# EAGLE design Group 13 Layout and sch v3 (EAGLE 9.2.0)
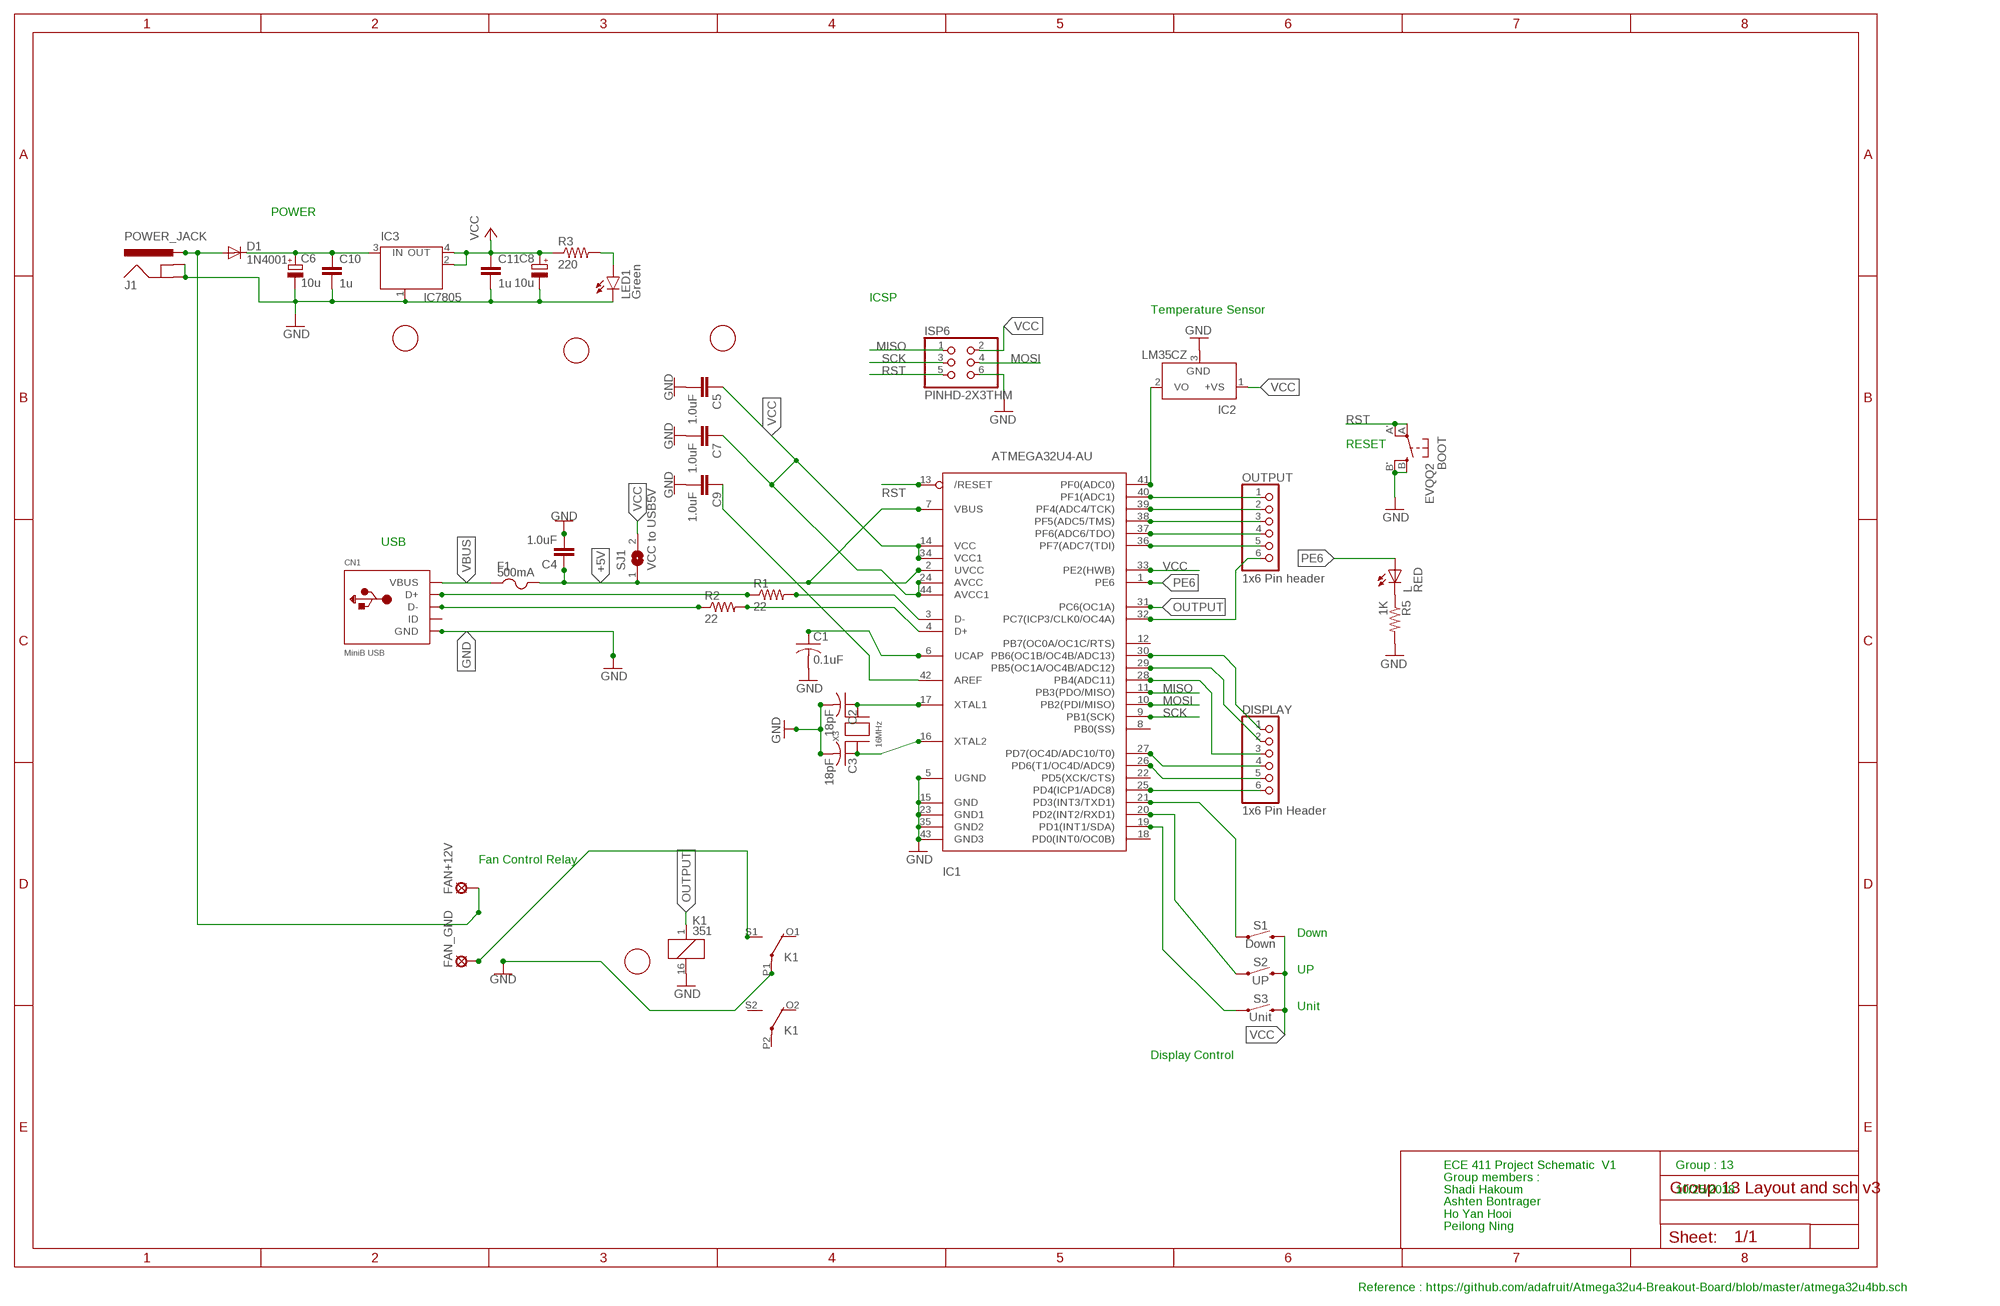
[diagram p0: schematic, sheet 1]

## Parts
BOOT  EVQQ2  [EVQ-Q2]
C1  0.1uF  C-USC0805K  [C0805K]
C2  18pF  C-USC0805K  [C0805K]
C3  18pF  C-USC0805K  [C0805K]
C4  1.0uF  1.0UF-0603-16V-10%  [0603]
C5  1.0uF  1.0UF-0603-16V-10%  [0603]
C6  10u  CPOL-EUC  [PANASONIC_C]
C7  1.0uF  1.0UF-0603-16V-10%  [0603]
C8  10u  CPOL-EUC  [PANASONIC_C]
C9  1.0uF  1.0UF-0603-16V-10%  [0603]
C10  1u  C-EUC0805  [C0805]
C11  1u  C-EUC0805  [C0805]
CN1  MiniB USB  USBMINIB  [USB-MINIB]
D1  1N4001  BYT85  [DO220S]
DISPLAY  1x6 Pin Header  PINHD-1X6B  [1X06-BIG]
F1  500mA  PTCFUSE-1206  [R1206]
FAN+12V  LSP10  [LSP10]
FAN_GND  LSP11  [LSP11]
IC1  ATMEGA32U4-AU  [TQFP44]
IC2  LM35CZ  [TO92]
IC3  IC7805  MC33269ST-3.3T3  [SOT223]
ISP6  PINHD-2X3THM  [ISP6]
J1  POWER_JACK  [POWER_JACK_PTH]
K1  351  [351]
L  RED  LEDCHIPLED_0805  [CHIPLED_0805]
LED1  Green  LED5MM  [LED5MM]
OUTPUT  1x6 Pin header  PINHD-1X6B  [1X06-BIG]
R1  22  R-US_R0805  [R0805]
R2  22  R-US_R0805  [R0805]
R3  220  R-US_R0805  [R0805]
R5  1K  R-US_R0805  [R0805]
S1  Down  MOMENTARY-SWITCH-SPST-PTH-6.0MM  [TACTILE_SWITCH_PTH_6.0MM]
S2  UP  MOMENTARY-SWITCH-SPST-PTH-6.0MM  [TACTILE_SWITCH_PTH_6.0MM]
S3  Unit  MOMENTARY-SWITCH-SPST-PTH-6.0MM  [TACTILE_SWITCH_PTH_6.0MM]
SJ1  VCC to USB5V  SJ  [SJ]
U$1  FIDUCIAL  [FIDUCIAL_1MM]
U$2  FIDUCIAL  [FIDUCIAL_1MM]
U$3  FIDUCIAL  [FIDUCIAL_1MM]
U$6  FIDUCIAL  [FIDUCIAL_1MM]
X3  16MHz  XTALNX5032  [NX5032]

## Nets
3.3V: C1.1 IC1.6(UCAP)
+5V: C4.1 F1.2 IC1.2(UVCC) IC1.7(VBUS) SJ1.1
D+: CN1.D+ R1.1
D-: CN1.D- R2.1
GND: BOOT.B'(S1) BOOT.B(S) C1.2 C2.2 C3.2 C4.2 C5.2 C6.- C7.2 C8.- C9.2 C10.2 C11.2 CN1.GND IC1.5(UGND) IC1.15(GND) IC1.23(GND1) IC1.35(GND2) IC1.43(GND3) IC2.3(GND) IC3.1(GND/ADJ) ISP6.6 J1.GND J1.GNDBREAK K1.16 K1.P1(2:P) LED1.K(C) R5.2
MISO: IC1.11(PB3(PDO/MISO)) ISP6.1
MOSI: IC1.10(PB2(PDI/MISO)) ISP6.4
N$1: DISPLAY.6 IC1.25(PD4(ICP1/ADC8))
N$2: C6.+ C10.1 D1.C IC3.3(IN)
N$3: IC1.3(D-) R1.2
N$4: IC1.4(D+) R2.2
N$5: LED1.A R3.2
N$7: IC1.40(PF1(ADC1)) OUTPUT.1
N$8: C2.1 IC1.17(XTAL1) X3.P$2
N$9: C3.1 IC1.16(XTAL2) X3.P$1
N$10: L.C R5.1
N$11: IC1.38(PF5(ADC5/TMS)) OUTPUT.3
N$12: DISPLAY.5 IC1.26(PD6(T1/OC4D/ADC9))
N$13: FAN_GND.MP K1.S1(2:S)
N$16: DISPLAY.4 IC1.27(PD7(OC4D/ADC10/T0))
N$17: DISPLAY.3 IC1.28(PB4(ADC11))
N$18: DISPLAY.2 IC1.29(PB5(OC1A/OC4B/ADC12))
N$19: DISPLAY.1 IC1.30(PB6(OC1B/OC4B/ADC13))
N$20: IC1.19(PD1(INT1/SDA)) S3.1
N$21: IC1.20(PD2(INT2/RXD1)) S2.1
N$22: IC1.21(PD3(INT3/TXD1)) S1.1
N$24: IC1.37(PF6(ADC6/TDO)) OUTPUT.4
N$25: IC1.36(PF7(ADC7(TDI)) OUTPUT.5
N$26: IC1.32(PC7(ICP3/CLK0/OC4A)) OUTPUT.6
N$28: C9.1 IC1.42(AREF)
N$29: D1.A FAN+12V.MP J1.PWR
OUTPUT: IC1.31(PC6(OC1A)) K1.1
PE6: IC1.1(PE6) L.A
PF4: IC1.39(PF4(ADC4/TCK)) OUTPUT.2
PF7: IC1.41(PF0(ADC0)) IC2.2(VO)
RST: BOOT.A'(P1) BOOT.A(P) IC1.13(/RESET) ISP6.5
SCK: IC1.9(PB1(SCK)) ISP6.3
VBUS: CN1.VBUS F1.1
VCC: C5.1 C7.1 C8.+ C11.1 IC1.14(VCC) IC1.24(AVCC) IC1.33(PE2(HWB)) IC1.34(VCC1) IC1.44(AVCC1) IC2.1(+VS) IC3.2(OUT) IC3.4(OUT) ISP6.2 R3.1 S1.3 S2.3 S3.3 SJ1.2
Unconnected: CN1.ID IC1.8(PB0(SS)) IC1.12(PB7(OC0A/OC1C/RTS)) IC1.18(PD0(INT0/OC0B)) IC1.22(PD5(XCK/CTS)) K1.O1(2:O) K1.O2(3:O) K1.P2(3:P) K1.S2(3:S)

## Notes on the sheet
- POWER
- ICSP
- Temperature Sensor
- RESET
- USB
- Fan Control Relay
- Down
- UP
- Unit
- Display Control
- ECE 411 Project Schematic  V1 | Group : 13
- Group members :
- Shadi Hakoum | 10/25/2018
- Ashten Bontrager
- Ho Yan Hooi
- Peilong Ning
- Reference : https://github.com/adafruit/Atmega32u4-Breakout-Board/blob/master/atmega32u4bb.sch

## Library data of the parts
BOOT = adaprog:EVQQ2
C1-C3 = adafruit:C-US: CAPACITOR, American symbol
C4 C5 C7 C9 = SparkFun-Capacitors:1.0UF: 1µF ceramic capacitors A capacitor is a passive two-terminal electrical component used to store electrical energy temporarily in an electric field.; PROD_ID: CAP-00868
C6 C8 = rcl:CPOL-EU: POLARIZED CAPACITOR, European symbol; SPICEPREFIX: C
C10 C11 = rcl:C-EU: CAPACITOR, European symbol; SPICEPREFIX: C
CN1 = adafruit:USB: USB Connectors USBMINIB - Surface Mount Female Mini-B USB Connector 4UConnector: 06564 By microbuilder.eu Thru-hole RA Female Mini-B USB Connector 4UConnector: 18732 By ladyada.net
D1 = diode:BYT85: DIODE
DISPLAY OUTPUT = adafruit:PINHD-1X6: PIN HEADER
F1 = adafruit:PTCFUSE: PTC fuses, resettable thermistors
FAN+12V = solpad:LSP10: SOLDER PAD drill 1.0 mm, distributor Buerklin, 12H555
FAN_GND = solpad:LSP11: SOLDER PAD drill 1.1 mm
IC1 = adaprog:ATMEGA32U4
IC2 = lm35:LM35: Single-Supply Centigrade Temperature Sensor Vout = (10mV/°C x Temp °C) +5mmmV Source: http://www.national.com/ds/LM/LM35.pdf
IC3 = linear:MC33269ST*: Adjustable Output Low Dropout Voltage Regulator 800 mA Source: http://www.onsemi.com/pub/Collateral/MC33269-D.PDF
ISP6 = adaprog:PINHD-2X3
J1 = SparkFun-Connectors:POWER_JACK: Power Jack Connector This is the standard 5.5mm barrel jack for power. The PTH is the most common, proven, reliable, footprint. The Slot footprint only works if the mill layer is transmitted to the PCB fab house so be warned. Here are the connectors we sell at SparkFun: DC Barrel Power Jack/Connector <https://www.sparkfun.com/products/119> (PRT-00119) DC Barrel Power Jack/Connector (SMD) <https://www.sparkfun.com/products/12748> (PRT-12748) DC Barrel Jack Adapter - Breadboard Compatible <https://www.sparkfun.com/products/10811> (PRT-10811) It is used on this SparkFun product (and many, many others): SparkFun RedBoard - Programmed with Arduino <https://www.sparkfun.com/products/12757> (DEV-12757) Also, if you need a mating power supply or connector, please check these out: Wall Adapter Power Supply - 9VDC 650mA <https://www.sparkfun.com/products/298> (TOL-00298) DC Barrel Jack Adapter - Male <https://www.sparkfun.com/products/10287> (PRT-10287); PROD_ID: CONN-08197
K1 = relay:351: RELAY 2 x switch, Omron; OC_FARNELL: unknown; OC_NEWARK: unknown
L = adafruit:LED: LED
LED1 = led:LED: LED
R1 R2 R5 = adafruit:R-US_: RESISTOR, American symbol
R3 = rcl:R-US_: RESISTOR, American symbol; SPICEPREFIX: R
S1-S3 = SparkFun-Switches:MOMENTARY-SWITCH-SPST: Momentary Switch (Pushbutton) - SPST Normally-open (NO) SPST momentary switches (buttons, pushbuttons). Variants PTH-12MM - 12mm square, through-hole Momentary Pushbutton Switch - 12mm Square <https://www.sparkfun.com/products/9190> (COM-09190) PTH-6.0MM, PTH-6.0MM-KIT - 6.0mm square, through-hole Mini Pushbutton Switch <https://www.sparkfun.com/products/97> (COM-00097) KIT package intended for soldering kit's - only one side of pads' copper is exposed. PTH-RIGHT-ANGLE-KIT - Right-angle, through-hole Right Angle Tactile Button <https://www.sparkfun.com/products/10791> - Used on SparkFun BigTime Watch Kit <https://www.sparkfun.com/products/11734> SMD-12MM - 12mm square, surface-mount Tactile Button - SMD (12mm) <https://www.sparkfun.com/products/12993> (COM-12993) Used on SparkFun PicoBoard <https://www.sparkfun.com/products/11888> SMD-4.5MM - 4.5mm Square Trackball Switch Used on SparkFun Blackberry Trackballer Breakout <https://www.sparkfun.com/products/13169> SMD-4.6MMX2.8MM - 4.60mm x 2.80mm, surface mount Used on SparkFun SAMD21 Mini Breakout <https://www.sparkfun.com/products/13664> SMD-5.2MM, SMD-5.2-REDUNDANT - 5.2mm square, surface-mount Mini Pushbutton Switch - SMD <https://www.sparkfun.com/products/8720> (COM-08720) Used on Arduino Pro Mini <https://www.sparkfun.com/products/11114> REDUNDANT package connects both switch circuits together SMD-6.0X3.5MM - 6.0 x 3.5mm, surface mount Momentary Reset Switch SMD <https://www.sparkfun.com/products/8229> (COM-08229) SMD-6.2MM-TALL - 6.2mm square, surface mount Tactile Button - SMD (6mm) <https://www.sparkfun.com/products/12992> Used on SparkFun Digital Sandbox <https://www.sparkfun.com/products/12651> SMD-RIGHT-ANGLE - Right-angle, surface mount Used on SparkFun Block for Intel® Edison - Arduino <https://www.sparkfun.com/products/13036>; PROD_ID: SWCH-08441; SF_SKU: COM-00097
SJ1 = jumper:SJ: SMD solder JUMPER
U$1-U$3 U$6 = adafruit:FIDUCIAL: For use by pick and place machines to calibrate the vision/machine, 1mm By microbuilder.eu
X3 = adaprog:XTAL

## Board
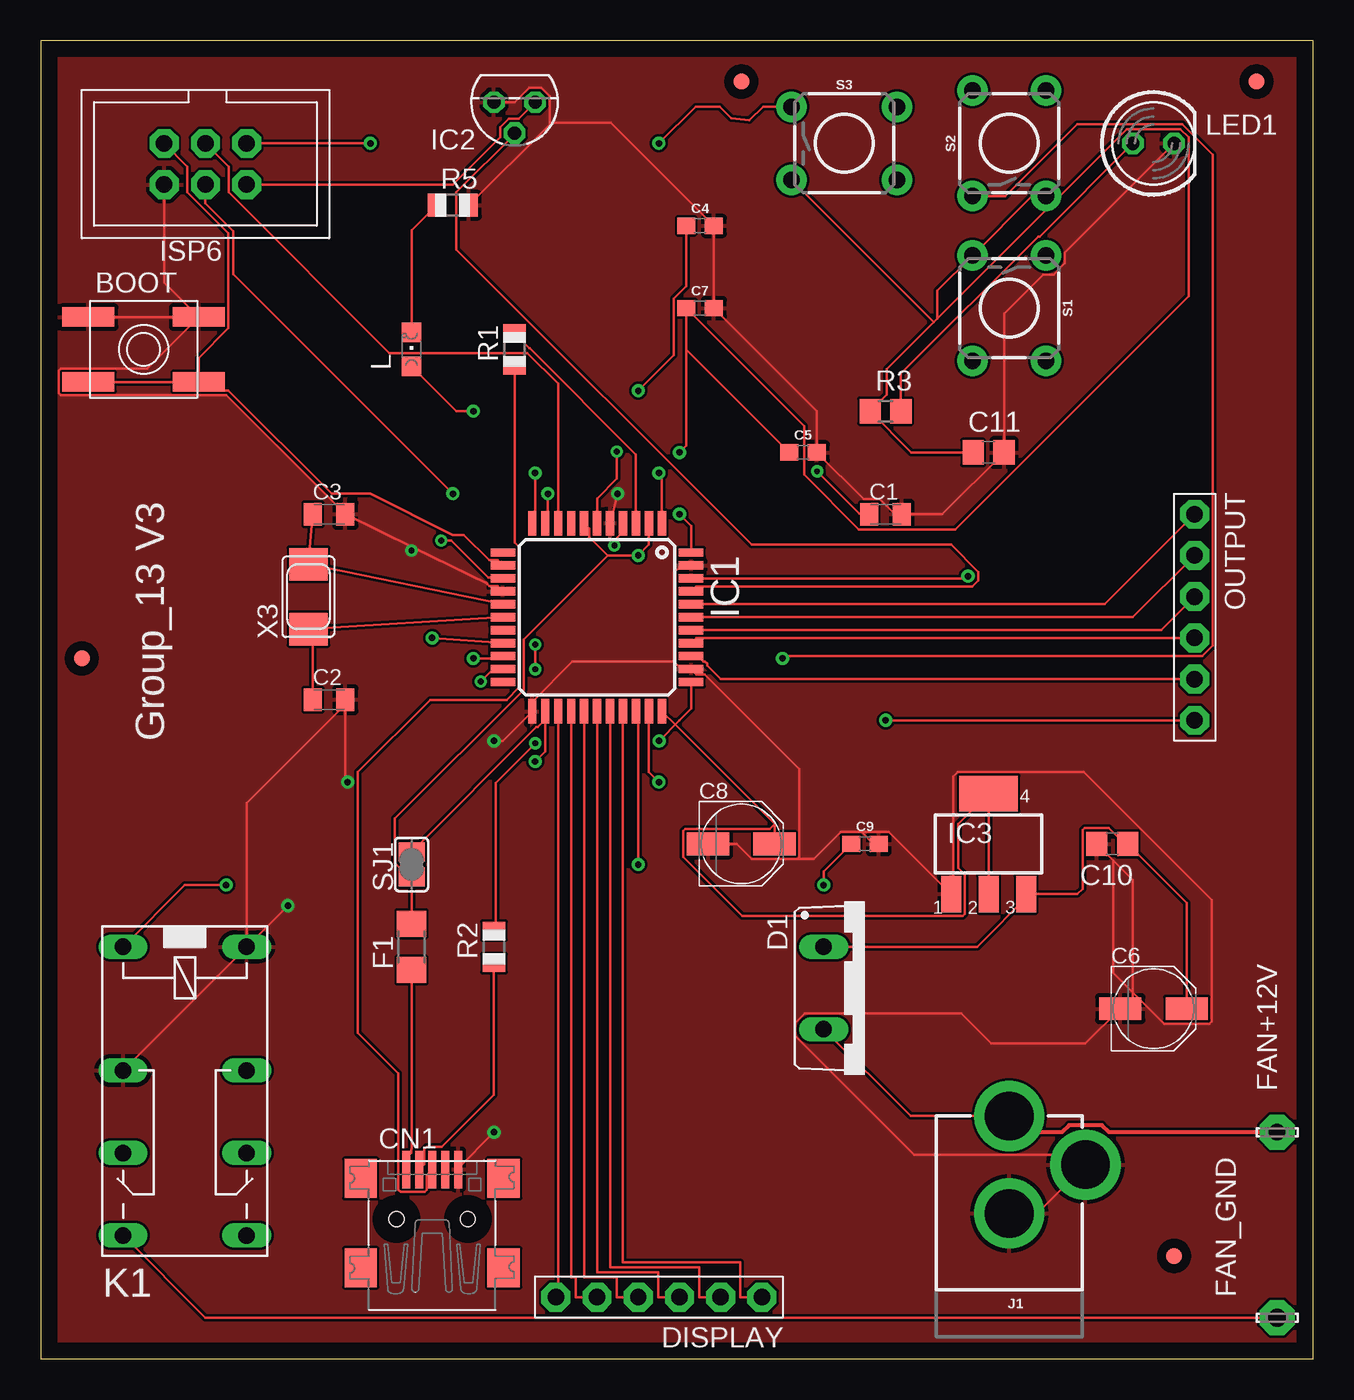
[diagram p1: board, top side]
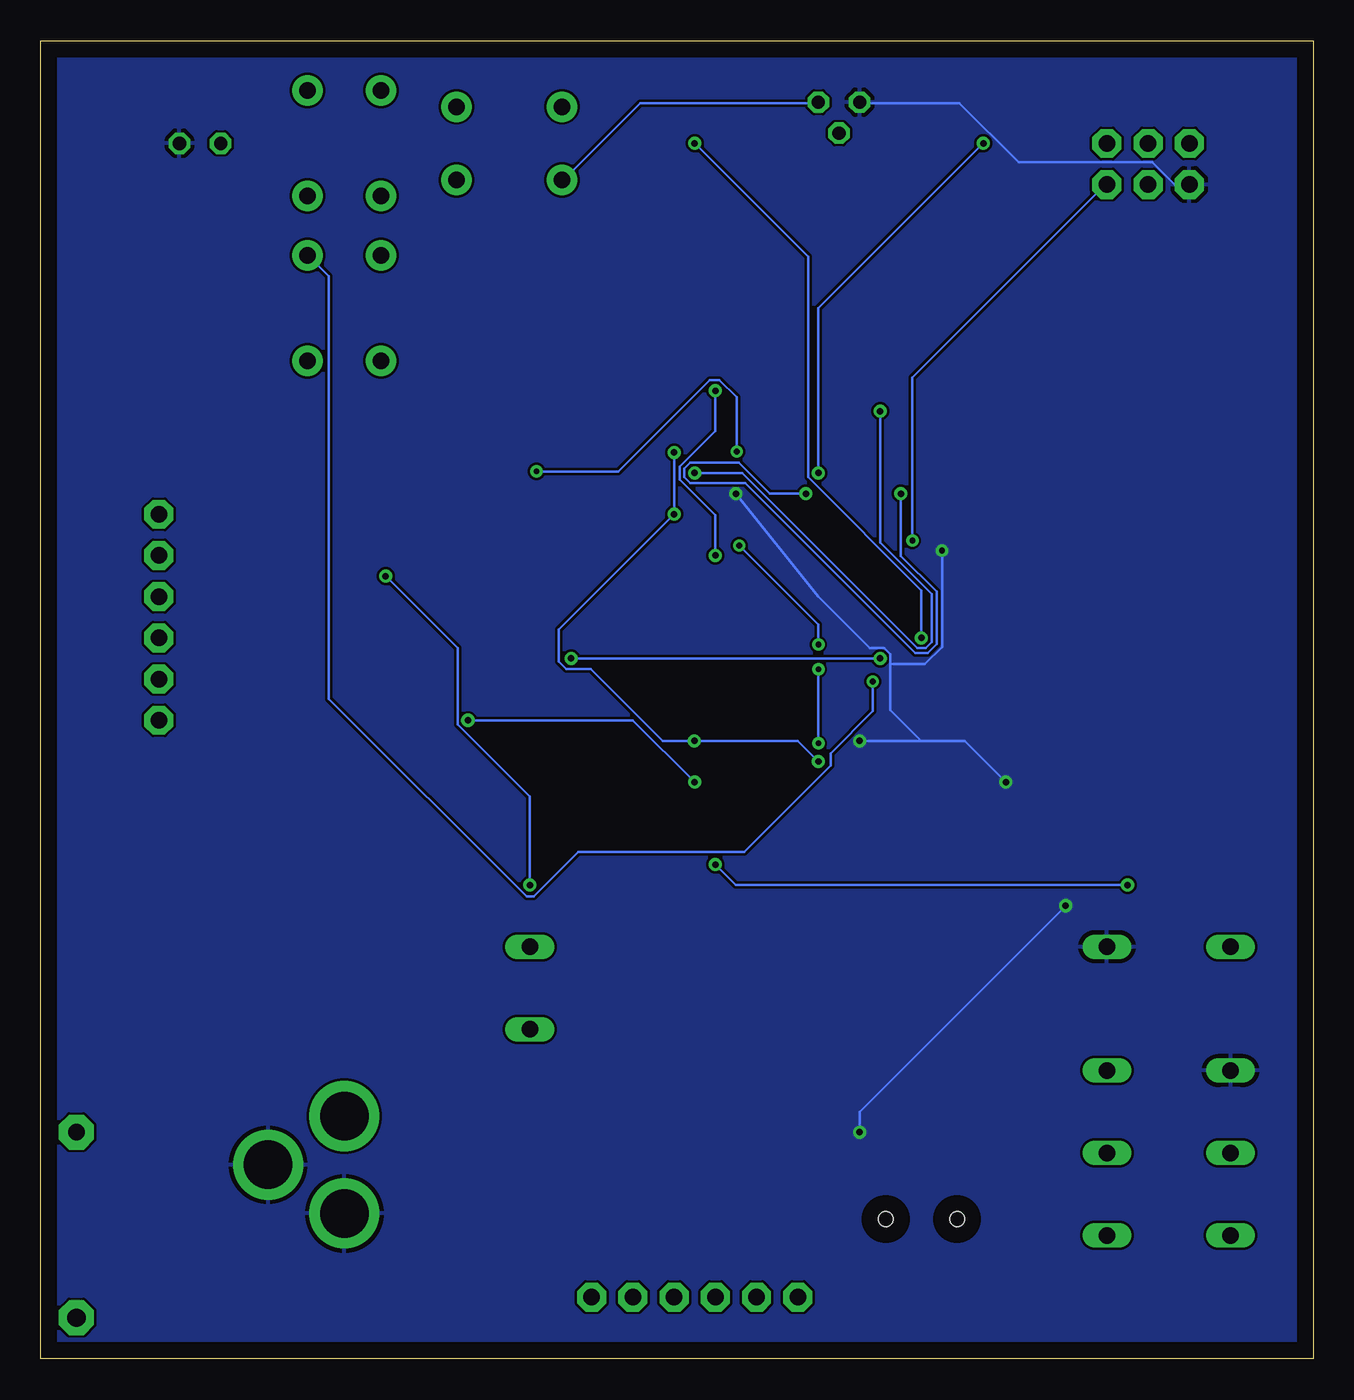
[diagram p2: board, bottom side, seen from below]

Size 78.41 x 81.27 mm. Coordinates in mm from the lower left corner, seen from the top.
Outline: 0,0 78.41,0 78.41,81.27 0,81.27 0,0
Copper layers (1*16): Top 0.035mm / dielectric 1.5mm / Bottom 0.035mm
Design rules "default": minimum track width 6mil, minimum drill 0.35mm, track to track 6mil, track to pad 6mil, pad to pad 6mil, via to via 6mil, smd to smd 6mil, copper to edge 40mil, drill to drill 6mil, minimum pad ring 10mil, minimum via ring 8mil, stop-mask expansion 4mil, vias tented up to drill 0mil, thermal gap 10mil

### Footprints (pad centres in the part's own frame; a part is rotated, then mirrored left to right if it is on the bottom)
EVQ-Q2 = smd 3.2 x 1.2: A -3.4,-2; A' 3.4,-2; B -3.4,2; B' 3.4,2
C0805K = smd 1.1 x 1.4: 1 -1,0; 2 1,0
0603 = smd 1.1 x 1: 1 -0.85,0; 2 0.85,0
PANASONIC_C = smd 2.6 x 1.4: + 2.05,0; - -2.05,0
C0805 = smd 1.3 x 1.5: 1 -0.95,0; 2 0.95,0
USB-MINIB = smd 0.5 x 2.308: D+ 0,4.064; D- -0.8,4.064; GND 1.6,4.064; ID 0.8,4.064; VBUS -1.6,4.064 | smd 2 x 2.4: GND1 -4.4,-2; GND2 -4.4,3.5; GND3 4.4,3.5; GND4 4.4,-2 | hole 0.9: -2.2,1; 2.2,1
DO220S = drill 1.016 long: A 2.54,-2.54; C -2.54,-2.54
1X06-BIG = drill 1.016 pad 1.778 octagon: 1 -6.35,0; 2 -3.81,0; 3 -1.27,0; 4 1.27,0; 5 3.81,0; 6 6.35,0
R1206 = smd 1.6 x 1.803: 1 -1.422,0; 2 1.422,0
LSP10 = drill 1.016 pad 2.159 octagon: MP 0,0
LSP11 = drill 1.118 pad 2.159 octagon: MP 0,0
TQFP44 = smd 1.5 x 0.5: 1 -5.8,4; 2 -5.8,3.2; 3 -5.8,2.4; 4 -5.8,1.6; 5 -5.8,0.8; 6 -5.8,0; 7 -5.8,-0.8; 8 -5.8,-1.6; 9 -5.8,-2.4; 10 -5.8,-3.2; 11 -5.8,-4; 23 5.8,-4; 24 5.8,-3.2; 25 5.8,-2.4; 26 5.8,-1.6; 27 5.8,-0.8; 28 5.8,0; 29 5.8,0.8; 30 5.8,1.6; 31 5.8,2.4; 32 5.8,3.2; 33 5.8,4 | smd 0.5 x 1.5: 12 -4,-5.8; 13 -3.2,-5.8; 14 -2.4,-5.8; 15 -1.6,-5.8; 16 -0.8,-5.8; 17 0,-5.8; 18 0.8,-5.8; 19 1.6,-5.8; 20 2.4,-5.8; 21 3.2,-5.8; 22 4,-5.8; 34 4,5.8; 35 3.2,5.8; 36 2.4,5.8; 37 1.6,5.8; 38 0.8,5.8; 39 0,5.8; 40 -0.8,5.8; 41 -1.6,5.8; 42 -2.4,5.8; 43 -3.2,5.8; 44 -4,5.8
TO92 = drill 0.813 octagon: 1 -1.27,0; 2 0,1.905; 3 1.27,0
SOT223 = smd 1.219 x 2.235: 1 -2.311,-3.099; 2 0,-3.099; 3 2.311,-3.099 | smd 3.6 x 2.2: 4 0,3.099
ISP6 = drill 1.016 pad 1.778 octagon: 1 -2.54,-1.27; 2 -2.54,1.27; 3 0,-1.27; 4 0,1.27; 5 2.54,-1.27; 6 2.54,1.27
POWER_JACK_PTH = drill 2.997 pad 4.318: GND 0,7.7; GNDBREAK 4.7,10.7; PWR 0,13.7
351 = drill 1.016 long: 1 -3.81,-3.81; 16 -3.81,3.81; O1 8.89,-3.81; O2 8.89,3.81; P1 3.81,-3.81; P2 3.81,3.81; S1 13.97,-3.81; S2 13.97,3.81
CHIPLED_0805 = smd 1.2 x 1.2: A 0,-1.05; C 0,1.05
LED5MM = drill 0.813 octagon: A -1.27,0; K 1.27,0
R0805 = smd 1.1 x 1.4: 1 -1,0; 2 1,0
R0805' = smd 1.3 x 1.5: 1 -0.95,0; 2 0.95,0
TACTILE_SWITCH_PTH_6.0MM = drill 1.016 pad 1.88: 1 -3.251,2.261; 2 3.251,2.261; 3 -3.251,-2.261; 4 3.251,-2.261
SJ = smd 1.168 x 1.6: 1 -0.762,0; 2 0.762,0
FIDUCIAL_1MM = smd 1 x 1: 1 0,0
NX5032 = smd 2 x 2.4: P$1 2,0; P$2 -2,0

### Placement (x,y rotation side)
BOOT  6.35,62.23 0 top
C1  52.07,52.07 0 top
C2  17.78,40.64 0 top
C3  17.78,52.07 0 top
C4  40.64,69.85 0 top
C5  46.99,55.88 0 top
C6  68.58,21.59 0 top
C7  40.64,64.77 0 top
C8  43.18,31.75 0 top
C9  50.8,31.75 0 top
C10  66.04,31.75 180 top
C11  58.42,55.88 0 top
CN1  24.13,7.62 0 top
D1  50.8,22.86 270 top
DISPLAY  38.1,3.81 180 top
F1  22.86,25.4 90 top
FAN+12V  76.2,13.97 0 top
FAN_GND  76.2,2.54 0 top
IC1  34.29,45.72 270 top
IC2  29.21,77.47 180 top
IC3  58.42,31.75 0 top
ISP6  10.16,73.66 180 top
J1  59.69,1.27 0 top
K1  8.89,21.59 270 top
L  22.86,62.23 0 top
LED1  68.58,74.93 0 top
OUTPUT  71.12,45.72 270 top
R1  29.21,62.23 90 top
R2  27.94,25.4 90 top
R3  220  [R0805']  52.07,58.42 0 top
R5  25.4,71.12 0 top
S1  59.69,64.77 270 top
S2  59.69,74.93 90 top
S3  49.53,74.93 0 top
SJ1  22.86,30.48 90 top
U$1  74.93,78.74 0 top
U$2  43.18,78.74 0 top
U$3  69.85,6.35 0 top
U$6  2.54,43.18 0 top
X3  16.51,46.99 90 top

### Tracks (layer width: path | path; a pad name or v marks a point on that pad's centre or on a via)
3.3V  (via drill 0.35)
  Top 0.152: v47.85,54.71 50.44,52.12 51.05,52.12 C1.1 | v35.51,55.93 35.51,54.25 34.29,53.03 IC1.6
  Bottom 0.152: v47.85,54.71 42.82,54.71 37.19,60.35 36.58,60.35 35.51,59.28 v35.51,55.93
+5V  (via drill 0.4 pad 0.75)
  Top 0.152: SJ1.1 22.86,29.53 | 22.86,29.53 F1.2 | C4.1 39.79,66.14 39.01,65.36 39.01,61.87 v36.83,59.69 | IC1.2 37.49,50.19 v36.83,49.53 34.96,49.53 | IC1.7 33.81,51.2 33.81,50.67 34.96,49.53 | 34.96,49.53 29.77,44.35 29.77,41.25 21.83,33.31 21.83,30.56 22.86,29.53
  Bottom 0.152: v36.83,59.69 36.83,57.2 39.04,55 39.04,54.22 36.83,52.02 v36.83,49.53
D+
  Top 0.152: R1.1 29.21,50.32 29.47,50.06 29.47,41.38 28.71,40.62 24,40.62 19.56,36.17 19.56,20.09 22.05,17.6 22.05,10.44 22.18,10.3 23.68,10.3 23.81,10.44 23.81,11.36 CN1.D+
D-
  Top 0.152: R2.1 27.94,16.29 24.71,13.07 23.79,13.07 23.65,12.93 23.65,12.01 CN1.D-
GND  (via drill 0.35, 0.4 pad 0.75)
  Top 0.152: BOOT.B BOOT.B' | ISP6.6 7.62,66.36 BOOT.B' | BOOT.B' 6.58,61.06 1.25,61.06 1.12,60.92 1.12,59.53 1.25,59.4 11.45,59.4 C3.2 23.02,50 | 23.02,50 27.51,47.8 27.51,47.77 27.64,47.64 28.17,47.64 IC1.15 | K1.16 12.7,34.27 19.05,40.62 C2.2 18.78,35.71 v18.93,35.56 | C9.2 51.32,31.75 50.59,32.48 | 50.59,32.48 49.3,32.48 47.65,30.82 46.62,30.82 | 50.59,32.48 52.28,32.48 55.72,29.05 | 55.72,29.05 IC3.1 | 46.62,30.82 43.84,30.82 42.91,31.75 C8.- | 46.62,30.82 46.76,30.95 46.76,36.38 40.94,42.2 40.41,42.2 IC1.35 40.08,42.67 39.32,42.67 39.01,42.98 | 55.72,29.05 56.25,29.58 56.25,35.9 56.52,36.18 64.29,36.18 72.16,28.3 72.16,20.8 72.03,20.66 69.23,20.66 66.11,23.79 66.11,30.73 C10.2 67.31,29.53 67.31,21.59 C6.- 64.39,19.45 58.59,19.45 56.73,21.31 47.09,21.31 46.51,20.73 46.51,19.91 53.84,12.58 63.78,12.58 J1.GNDBREAK 61.31,8.89 59.77,8.89 J1.GND | K1.16 K1.P1 | K1.16 v15.24,27.94 | v27.94,13.97 25.73,11.76 CN1.GND | 31.37,76.09 31.37,77.84 30.85,78.36 30.11,78.36 29.22,77.47 IC2.3 | 31.37,76.09 R5.2 | 31.37,76.09 31.48,76.2 35.14,76.2 C4.2 C7.2 47.84,58.42 C5.2 50.72,53 51.72,53 52.64,52.07 C1.2 55.56,52.07 C11.2 59.37,64.45 61.77,66.85 62.44,66.85 63.12,67.54 63.12,68.2 LED1.K | v27.94,38.1 28.47,38.1 IC1.23 30.33,39.93 30.33,40.54 32.77,42.98 39.01,42.98 | IC1.5 v35.56,53.34 | 39.01,42.98 39.01,48.46 39.32,48.77 40.08,48.77 IC1.43 | v22.86,49.84 23.01,49.99 23.02,50
  Bottom 0.152: v15.24,27.94 27.94,15.24 v27.94,13.97 | v18.93,35.56 21.47,38.1 24.13,38.1 | 24.13,38.1 v27.94,38.1 | v35.56,53.34 30.48,46.99 27.3,43.81 26.41,43.81 26.04,43.44 26.04,42.82 | 24.13,38.1 26.04,40.01 26.04,42.82 | 26.04,42.82 23.93,42.82 22.86,43.89 v22.86,49.84 | ISP6.6 8.53,72.39 9.91,73.76 18.14,73.76 21.79,77.42 27.89,77.42 IC2.3
  pour Top: -1.27,82.55 79.76,82.55 80.01,82.3 80.01,71.12 80.01,-2.29 79.76,-2.54 -1.27,-2.54
  pour Bottom: -1.27,82.55 79.76,82.55 80.01,82.3 80.01,78.74 80.01,-1.02 79.76,-1.27 78.74,-1.27 -1.27,-1.27
MISO  (via drill 0.4 pad 0.75)
  Top 0.152: ISP6.1 v20.32,74.93 | v30.48,54.61 30.48,51.71 IC1.11
  Bottom 0.152: v20.32,74.93 30.48,64.77 v30.48,54.61
MOSI  (via drill 0.4 pad 0.75)
  Top 0.152: ISP6.4 10.16,71.24 11.88,69.52 11.88,66.86 v25.4,53.34 | v31.26,53.34 31.26,51.69 IC1.10
  Bottom 0.152: v25.4,53.34 25.4,49.5 23.19,47.29 23.19,44.06 23.74,43.51 24.52,43.51 34.98,53.98 38.36,53.98 38.73,54.35 38.73,54.87 38.36,55.24 35.38,55.24 33.48,53.34 v31.26,53.34
N$1
  Top 0.152: IC1.25 31.89,3.95 DISPLAY.6
N$2
  Top 0.152: C6.+ 70.63,28.11 C10.1 66.81,31.75 65.83,32.73 64.34,32.73 64.21,32.59 64.21,28.97 63.89,28.65 60.96,28.65 | 60.96,28.65 IC3.3 | D1.C 57.71,25.4 60.96,28.65
N$3
  Top 0.152: R1.2 30.13,62.31 36.69,55.75 IC1.3
N$4  (via drill 0.35)
  Top 0.152: v30.48,37.95 28.04,35.51 28.04,26.52 R2.2 | v30.48,44.04 v30.48,42.52 | v35.36,50.14 35.36,50.44 35.81,50.9 35.81,51.51 IC1.4
  Bottom 0.152: v30.48,42.52 v30.48,37.95 | v30.48,44.04 30.48,45.26 v35.36,50.14
N$5
  Top 0.152: LED1.A 61.57,69.19 61.47,69.19 53.02,60.74 R3.2
N$7
  Top 0.152: OUTPUT.1 65.57,46.52 IC1.40
N$8
  Top 0.152: IC1.17 X3.P$2 16.78,44.99 C2.1
N$9
  Top 0.152: IC1.16 X3.P$1 C3.1
N$10
  Top 0.152: R5.1 22.86,69.58 L.C
N$11
  Top 0.152: IC1.38 69.05,44.92 OUTPUT.3
N$12
  Top 0.152: IC1.26 32.69,5.03 32.97,5.03 32.97,3.81 DISPLAY.5
N$13
  Top 0.152: K1.S1 10.16,2.54 FAN_GND.MP
N$16
  Top 0.152: IC1.27 33.49,5.03 35.51,5.03 35.51,3.81 DISPLAY.4
N$17
  Top 0.152: DISPLAY.3 38.05,3.81 38.05,5.33 34.29,5.33 IC1.28
N$18
  Top 0.152: DISPLAY.2 40.59,3.81 40.59,5.64 35.09,5.64 IC1.29
N$19
  Top 0.152: DISPLAY.1 43.13,3.81 43.13,5.94 35.89,5.94 IC1.30
N$20  (via drill 0.4 pad 0.75)
  Top 0.152: v38.1,74.93 40.36,77.19 41.84,77.19 42.55,76.48 43.67,76.35 44.52,77.19 S3.1 | v24.13,44.45 IC1.19
  Bottom 0.152: v38.1,74.93 31.11,67.94 31.11,54.35 24.13,47.37 v24.13,44.45
N$21  (via drill 0.4 pad 0.75)
  Top 0.152: v45.72,43.18 45.87,43.33 71.58,43.33 72.24,43.99 72.24,74.23 70.34,76.12 63.88,76.12 59.44,71.68 S2.1 | v26.67,43.18 28.35,43.18 IC1.20
  Bottom 0.152: v45.72,43.18 v26.67,43.18
N$22  (via drill 0.35)
  Top 0.152: v27.13,41.76 27.89,42.52 28.35,42.52 IC1.21
  Bottom 0.152: v27.13,41.76 27.13,39.93 29.72,37.34 29.72,36.58 35.05,31.24 45.26,31.24 48.01,28.5 48.46,28.5 60.66,40.69 60.66,66.75 61.87,67.97 S1.1
N$24
  Top 0.152: OUTPUT.4 40.94,44.45 40.94,44.44 40.41,44.44 IC1.37
N$25
  Top 0.152: OUTPUT.5 41.91,41.91 41.07,42.75 41.07,42.87 40.94,43 40.82,43 40.5,43.32 IC1.36
N$26  (via drill 0.4 pad 0.75)
  Top 0.152: OUTPUT.6 v52.07,39.37 | v38.1,35.56 37.49,36.17 IC1.32
  Bottom 0.152: v52.07,39.37 41.91,39.37 v38.1,35.56
N$28  (via drill 0.4 pad 0.75)
  Top 0.152: IC1.42 57.01,48.12 v57.15,48.26 | v48.26,29.21 48.26,30.06 C9.1
  Bottom 0.152: v57.15,48.26 52.7,43.81 52.7,39.11 48.26,34.67 v48.26,29.21
N$29
  Top 0.152: D1.A 53.61,14.97 J1.PWR 60.69,13.97
  Top 0.254: FAN+12V.MP 65.84,13.97 65.4,14.41 63.38,14.41 62.94,13.97 60.69,13.97
OUTPUT  (via drill 0.4 pad 0.75)
  Top 0.152: K1.1 8.89,29.21 v11.43,29.21 | v36.83,30.48 36.83,39.78 IC1.31
  Bottom 0.152: v11.43,29.21 35.56,29.21 v36.83,30.48
PE6  (via drill 0.4 pad 0.75)
  Top 0.152: L.A 25.62,58.42 v26.67,58.42 | v38.1,54.61 38.29,54.42 IC1.1
  Bottom 0.152: v26.67,58.42 26.67,50.34 23.5,47.17 23.5,44.19 23.87,43.82 24.39,43.82 35.18,54.61 v38.1,54.61
PF4
  Top 0.152: OUTPUT.2 67.31,45.72 IC1.39
PF7
  Top 0.152: IC2.2 29.21,75.5 25.62,71.92 25.62,68.39 43.81,50.2 56.1,50.2 57.78,48.52 57.78,48 57.41,47.63 40.4,47.63 IC1.41
RST
  Top 0.152: BOOT.A BOOT.A' | BOOT.A' 9.75,61.71 11.58,63.53 11.58,69.39 9.04,71.93 9.04,73.51 ISP6.5 | BOOT.A' 10.27,59.71 11.57,59.71 17.94,53.34 20.32,53.34 25.4,50.8 26.09,50.8 27.64,49.24 28.17,49.24 IC1.13
SCK
  Top 0.152: ISP6.3 11.58,73.51 11.58,71.93 21.5,62.01 30,62.01 31.89,60.12 IC1.9
VBUS
  Top 0.152: F1.1 22.86,12.94 22.85,12.93 22.85,12.7 22.53,12.38 CN1.VBUS
VCC  (via drill 0.35, 0.4 pad 0.75)
  Top 0.152: SJ1.2 30.56,38.94 30.64,38.94 31.09,39.4 IC1.24 31.09,37.44 v30.48,36.83 | IC1.33 39.1,39.1 | 39.1,39.1 45.23,32.98 | 45.23,32.98 C8.+ | IC1.34 40.09,40.09 39.37,39.37 | 39.37,39.37 39.1,39.1 | IC3.2 IC3.4 56.55,32.98 56.55,30.26 56.95,29.86 56.95,27.44 56.81,27.3 43.25,27.3 39.6,30.95 39.6,32.55 39.73,32.68 44.93,32.68 45.23,32.98 | ISP6.2 25.4,72.39 28.32,75.31 28.32,75.93 28.84,76.45 29.46,76.45 IC2.1 | C7.1 39.79,62.23 C5.1 | C11.1 53.66,55.88 R3.1 52.14,59.44 52.14,61.02 55.03,63.91 | 55.25,64.13 66.94,75.82 70.22,75.82 70.74,75.3 70.74,65.53 56.35,51.14 50.42,51.14 47.06,54.51 47.06,57.5 C7.1 | 55.25,64.13 55.03,63.91 | 55.03,63.91 S3.3 | C7.1 39.79,56.3 v39.37,55.88 | v39.37,52.07 40.09,51.35 IC1.44 | S2.3 61.09,71.68 S1.3 55.25,65.84 55.25,64.13 | v38.12,38.1 39.37,39.35 39.37,39.37 | v24.69,50.44 25.3,50.44 27.58,48.16 28.35,48.16 IC1.14
  Bottom 0.152: v39.37,55.88 v39.37,52.07 46.48,44.96 46.48,42.98 46.02,42.52 44.5,42.52 40.08,38.1 v38.12,38.1 31.75,38.1 v30.48,36.83 | v24.69,50.44 24.69,60.5 12.8,72.39 ISP6.2 | IC2.1 30.48,77.42 41.45,77.42 46.18,72.69 S3.3

### Text on the board
tPlace: Group_13 V3